# EAGLE schematic fonte3 (EAGLE 9.6.2)
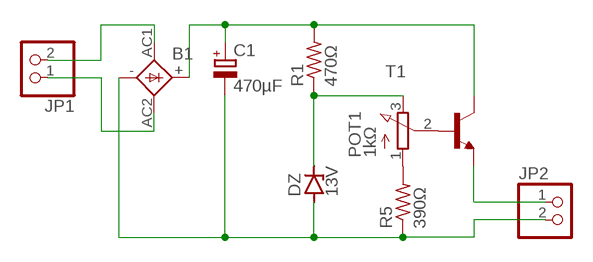
[diagram p0: schematic, sheet 1]

## Parts
B1  1KAB  [1KAB]
C1  470µF  CPOL-EUE5-10.5  [E5-10,5]
DZ  13V  BZD23  [SOD81]
JP1  PINHD-1X2  [1X02]
JP2  PINHD-1X2  [1X02]
POT1  1kΩ  3RP/1610N  [3RP/1610N]
R1  470Ω  R-US_0204/5  [0204/5]
R5  390Ω  R-US_0204/5  [0204/5]
T1  -NPN-SOT93V  [SOT93V]

## Nets
N$1: B1.AC1 JP1.2
N$2: B1.AC2 JP1.1
N$3: B1.+ C1.+ R1.2 T1.C
N$4: POT1.1(A) R5.2
N$5: POT1.2(S) T1.B
N$6: JP2.1 T1.E
N$10: B1.- C1.- DZ.A DZ.C JP2.2 POT1.3(E) R1.1 R5.1

## Library data of the parts
B1 = rectifier:1KAB: RECTIFIER grid 5,08 x 5,08 mm
C1 = resistor:CPOL-EU: POLARIZED CAPACITOR, European symbol
DZ = diode:BZD23: Z DIODE
JP1 JP2 = pinhead:PINHD-1X2: PIN HEADER
POT1 = pot:3RP/1610N: 16mm Potentiometer one level Source: http://www.alphapotentiometers.net/html/16mm_pot_2.html
R1 R5 = rcl:R-US_: RESISTOR, American symbol; SPICEPREFIX: R
T1 = transistor:*-NPN-: NPN Transistror BF959 corrected 2008.03.06

## Module RESISTANCE
Ports: 

### Library data of the parts